# Altium schematic sheet opto_board_wiring.SchDoc
size A4
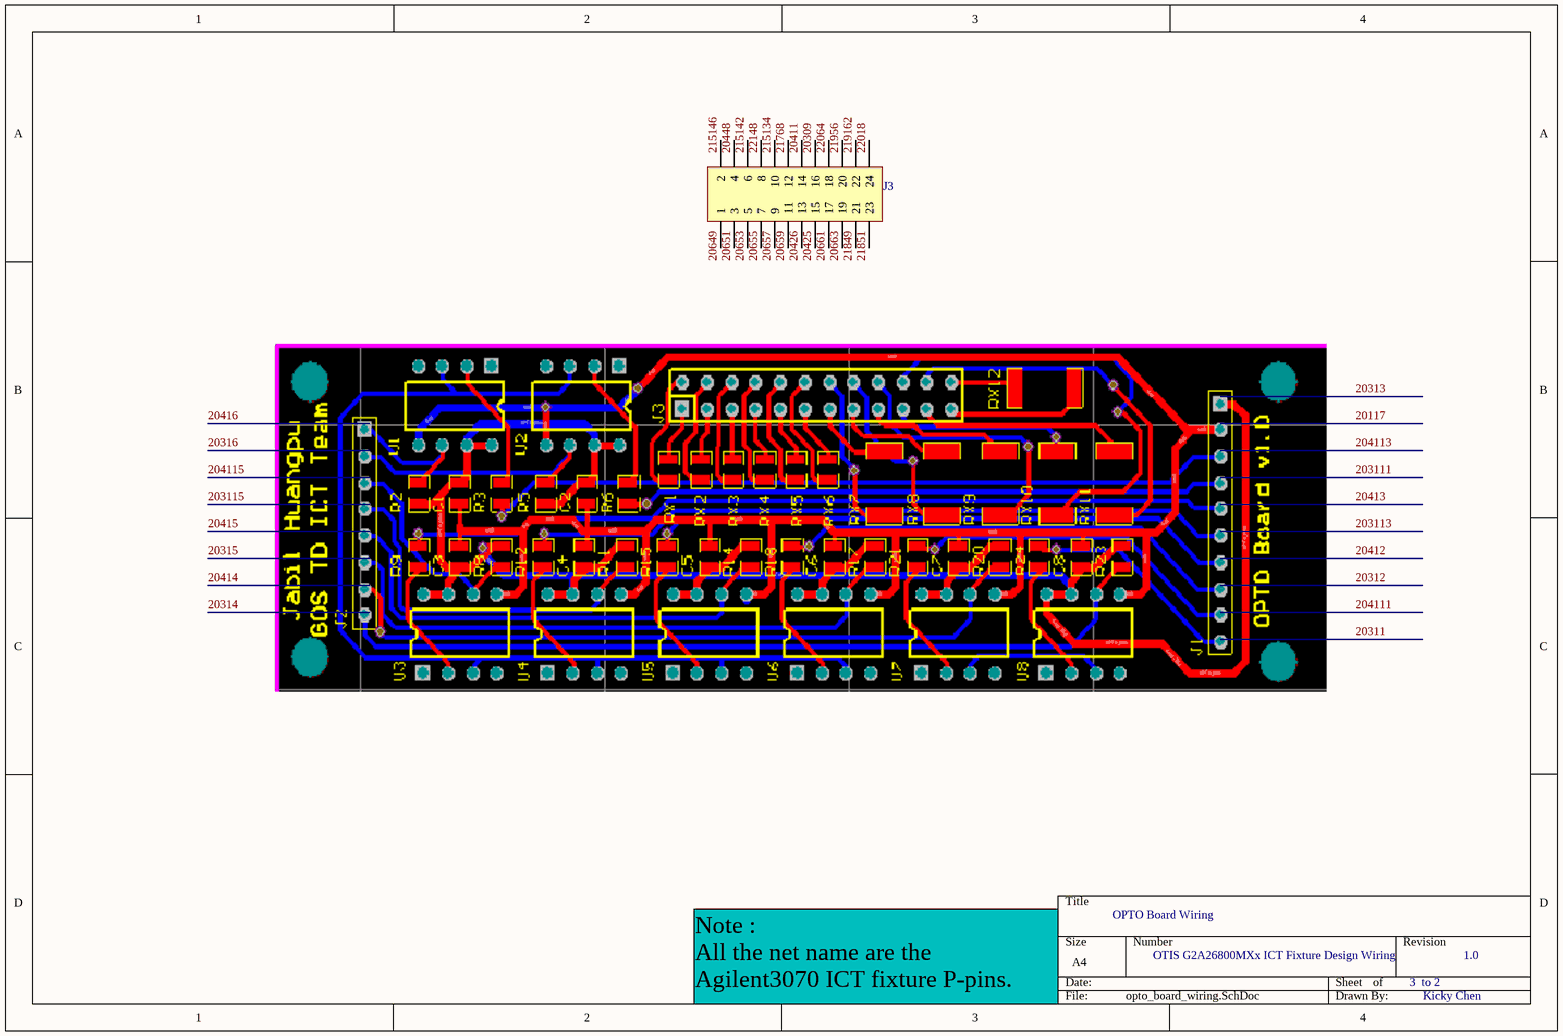
[diagram p0: opto_board_wiring.SchDoc]

## Parts
J3  Header 12X2  [HDR2X12]  (value not drawn)

## Nets

Not connected (* = marked no-connect by the designer): J3 1 2 3 4 5 6 7 8 9 10 11 12 13 14 15 16 17 18 19 20 21 22 23 24

## Notes on the sheet
- OPTO Board Wiring
- OTIS G2A26800MXx ICT Fixture Design Wiring
- 3  to 2
- 1.0
- Note :
  All the net name are the Agilent3070 ICT fixture P-pins.
- Kicky Chen
- Labels drawn without touching a wire or pin: 20309, 20411, 20425, 20426, 20448, 20649, 20651, 20653, 20655, 20657, 20659, 20661, 20663, 21768, 21849, 21851, 21956, 22018, 22064, 22148, 215134, 215142, 215146, 219162

## Library data of the parts
J3 = Header 12X2: Header, 12-Pin, Dual row; LatestRevisionDate: 17-Jul-2002; LatestRevisionNote: Re-released for DXP Platform.; Publisher: Altium Limited